# Altium schematic sheet CIRCUIT.SchDoc
size A3; DocumentNumber: 3; SheetNumber: 4; SheetTotal: 6; PageSetup: Record=PageOptions|CenterHorizontal=True|CenterVertical=True|PrintScale=1.00|XCorrection=1.00|YCorrection=1.00|PrintKind=1|BorderSize=5000000|LeftOffset=0|BottomOffset=0|Orientation=2|PaperLength=1000|PaperWidth=1000|Scale=100|PaperSource=7|PrintQuality=-3|MediaType=1|DitherType=10|PrintScaleMode=1|PaperKind=A4|PaperIndex=9
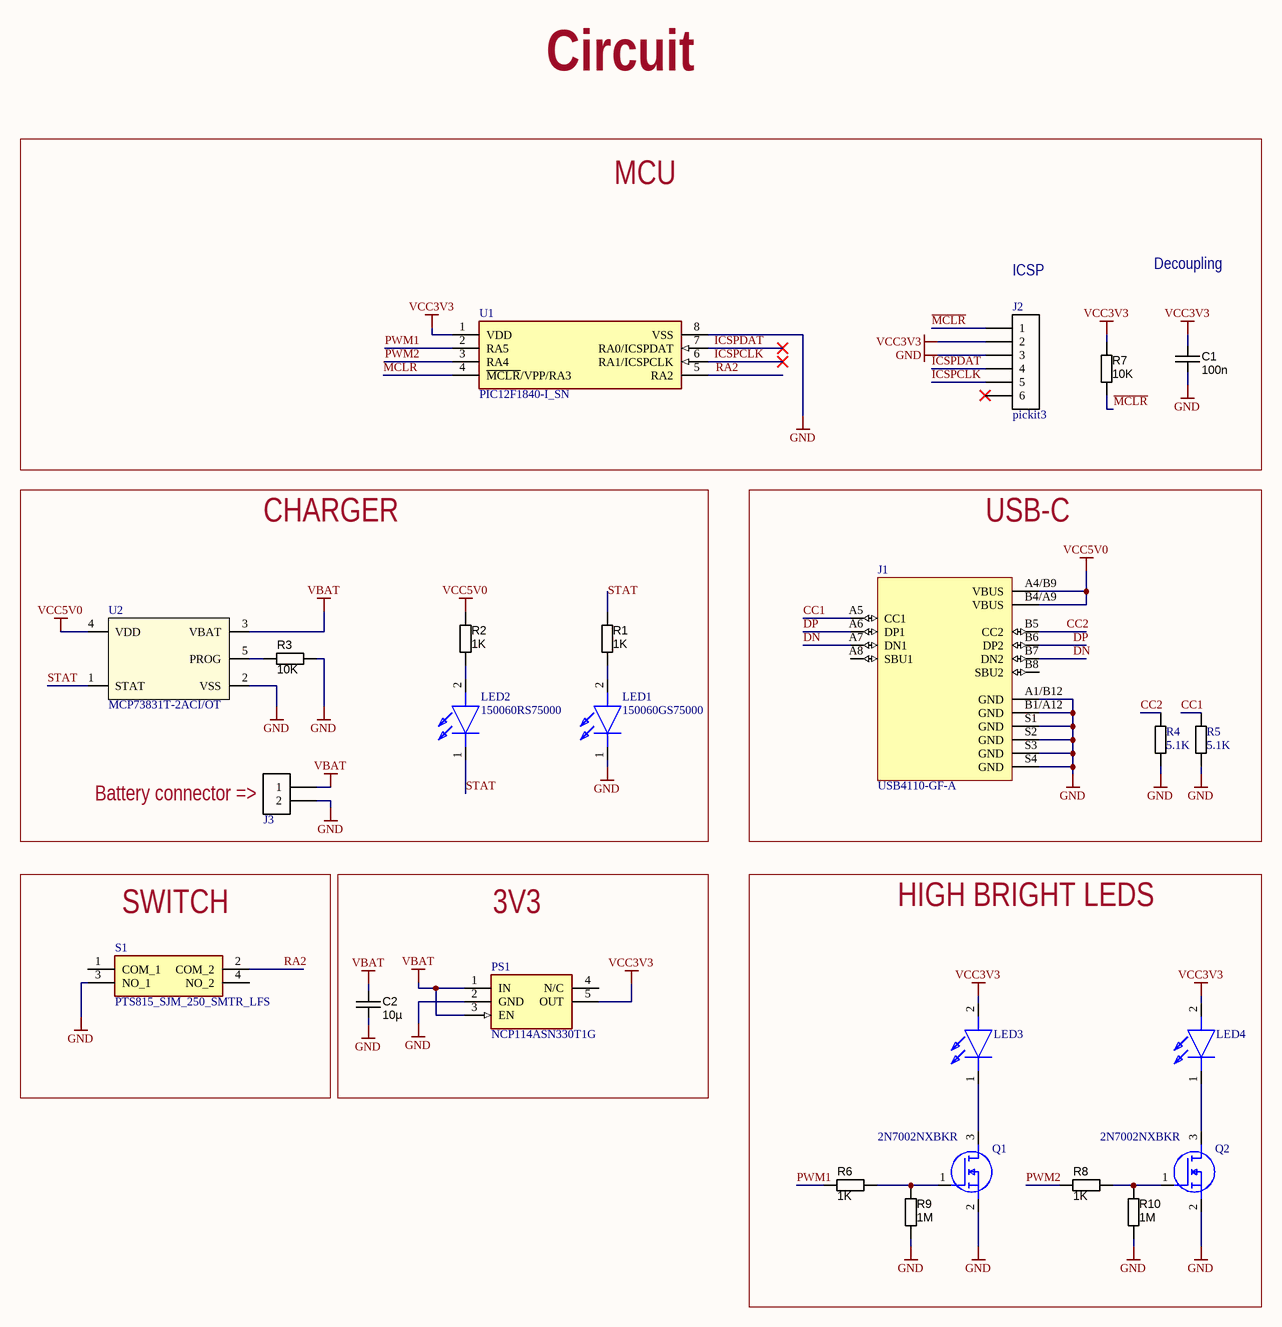
[diagram p0: CIRCUIT.SchDoc]

## Parts
C1  value 100n  [CAPC1608X90N]  (hidden comment: approved sub OK)
C2  value 10µ  [CAPC3216X180N]  (hidden comment: approved sub OK)
J1  USB4110-GF-A  [GCT_USB4110-GF-A]
J2  pickit3  [CONN_ICSP]  (no BOM)
J3  S2B-PH-K-S(LF)(SN)  [JST-S2B-PH-K-S_V]  (value not drawn)
LED1  150060GS75000  [LEDC1608X80N]
LED2  150060RS75000  [LEDC1608X80N]
LED3  S1W0-2835408003-0000003S-00005  [STW8A12DMinJ18CAAll]  (value not drawn)
LED4  S1W0-2835408003-0000003S-00005  [STW8A12DMinJ18CAAll]  (value not drawn)
PS1  NCP114ASN330T1G  [SOT95P275X110-5N]
Q1  2N7002NXBKR  [SOT95P230X110-3N]
Q2  2N7002NXBKR  [SOT95P230X110-3N]
R1  value 1K  [RESC1608X55N]  (hidden comment: Thick Film)
R2  value 1K  [RESC1608X55N]  (hidden comment: Thick Film)
R3  value 10K  [RESC1608X55N]  (hidden comment: Thick Film)
R4  value 5.1K  [RESC1608X55N]  (hidden comment: RES 5.1K OHM 5% 1/10W 0603)
R5  value 5.1K  [RESC1608X55N]  (hidden comment: RES 5.1K OHM 5% 1/10W 0603)
R6  value 1K  [RESC1608X55N]  (hidden comment: Thick Film)
R7  value 10K  [RESC1608X55N]  (hidden comment: Thick Film)
R8  value 1K  [RESC1608X55N]  (hidden comment: Thick Film)
R9  value 1M  [RESC1608X55N]  (hidden comment: Thick Film)
R10  value 1M  [RESC1608X55N]  (hidden comment: Thick Film)
S1  PTS815_SJM_250_SMTR_LFS  [PTS815SJM250SMTRLFS]
U1  PIC12F1840-I_SN  [SOIC127P600X175-8N]
U2  MCP73831T-2ACI/OT  [SOT-23-5_MC_MCH]

## Blocks framed on the sheet
MCU: C1 J2 R7 U1
CHARGER: J3 LED1 LED2 R1-R3 U2
USB-C: J1 R4 R5
SWITCH: S1
3V3: C2 PS1
HIGH BRIGHT LEDS: LED3 LED4 Q1 Q2 R6 R8-R10

## Nets
GND: C1.1 C2.2 J1.A1/B12(GND) J1.B1/A12(GND) J1.S1(GND) J1.S2(GND) J1.S3(GND) J1.S4(GND) J2.3 J3.2 LED1.1(K) PS1.2(GND) Q1.2(S) Q2.2(S) R3.2 R4.1 R5.1 R9.2 R10.2 S1.3(NO_1) U1.8(VSS) U2.2(VSS)
VBAT: C2.1 J3.1 PS1.1(IN) PS1.3(EN) U2.3(VBAT)
VCC3V3: C1.2 J2.2 LED3.2(A) LED4.2(A) PS1.5(OUT) R7.1 U1.1(VDD)
VCC5V0: J1.A4/B9(VBUS) J1.B4/A9(VBUS) R2.1 U2.4(VDD)
CC1: J1.A5(CC1) R5.2
CC2: J1.B5(CC2) R4.2
DN: J1.A7(DN1) J1.B7(DN2)
DP: J1.A6(DP1) J1.B6(DP2)
ICSPCLK: J2.5 U1.6(RA1/ICSPCLK)
ICSPDAT: J2.4 U1.7(RA0/ICSPDAT)
~{MCLR}: J2.1 R7.2 U1.4(~{MCLR}/VPP/RA3)
PWM1: R6.1 U1.2(RA5)
PWM2: R8.1 U1.3(RA4)
RA2: S1.2(COM_2) U1.5(RA2)
STAT: LED2.1(K) R1.1 U2.1(STAT)
NetLED1_2: LED1.2(A) R1.2
NetLED2_2: LED2.2(A) R2.2
NetLED3_1: LED3.1(K) Q1.3(D)
NetLED4_1: LED4.1(K) Q2.3(D)
NetQ1_1: Q1.1(G) R6.2 R9.1
NetQ2_1: Q2.1(G) R8.2 R10.1
NetR3_1: R3.1 U2.5(PROG)

Not connected (* = marked no-connect by the designer): J1 A8(SBU1) B8(SBU2); J2 6*; PS1 4(N/C); S1 1(COM_1) 4(NO_2)

## Notes on the sheet
- Circuit
- (near J2) ICSP
- Decoupling
- (near J3) Battery connector =>
- Project:
- Revision:
- Engineer:
- Title:
- Pag
- of
- Date:
- Hour:
- Variant:
- Embedded Things

## Library data of the parts
C1 = CAPC_100n_0603_X7R_50V_10%: Capacitor SMD Cer 100nF 10% 50V X7R 0603; Manufacturer 1: AVX Corporation; Manufacturer Part Number 1: 06035C104KAT2A; Ratings: 50V; X7R; Material: ceramic; SCDType: spec; Manufacturer 2: TDK Corporation; Manufacturer Part Number 2: C1608X7R1H104K; Package / Case: 0603 (1608 Metric); Tolerance: ±10%; Supplier 1: Digi-Key; Supplier Part Number 1: 478-5052-1-ND; ComponentLink1URL: http://www.avx.com/docs/Catalogs/cx7r.pdf; ComponentLink1Description: http://www.avx.com/docs/Catalogs/cx7r.pdf; Supplier 2: Digi-Key; Supplier Part Number 2: 445-1314-1-ND; ComponentLink2URL: http://product.tdk.com/capacitor/mlcc/en/documents/mlcc_commercial_general_en.pdf; ComponentLink2Description: http://product.tdk.com/capacitor/mlcc/en/documents/mlcc_commercial_general_en.pdf
C2 = CAPC_10u_1206_25V: Capacitor SMD Cer 10uF 10% 25V X7R 1206; Ratings: 16V; X7R; Material: ceramic; SCDType: spec; Package / Case: 1206 (3216 metric); Tolerance: ±10%; Supplier 1: Digi-Key; Supplier Part Number 1: 1276-1804-1-ND
J1 = USB4110-GF-A: USB-C _USB TYPE-C_ USB 2.0 Receptacle Connector 24 _16+8 Dummy_ Position Surface Mount, Right Angle; Through Hole; MF: GCT; Digi-Key_Purchase_URL: https://www.digikey.com/product-detail/en/gct/USB4110-GF-A/2073-USB4110-GF-A-1-ND/10384548?utm_source=snapeda&utm_medium=aggregator&utm_campaign=symbol; Value: *; Package: None; MP: USB4110-GF-A; SnapEDA_Link: https://www.snapeda.com/parts/USB4110-GF-A/Global%20Connector%20Technology/view-part/4001167/?ref=snap; Digi-Key_Part_Number: 2073-USB4110-GF-A-1-ND
J2 = CONN PROG PICKIT3: CONN PROG PICKIT3 6VIAS; pitch_in_mm: 2.54; device: pickit3
J3 = CONN JST 2P 2MM: Male Header, Pitch 2 mm, 1 x 2 Position, Height 4.8 mm, Tail Length 3.4 mm, -25 to 85 degC, RoHS, Bulk; Case\Package: Radial; Tolerance: 20%; Capacitance: 10 uF; Voltage Rating (DC): 50 V; Packaging: Bulk; ComponentLink1URL: http://www.jst-mfg.com/product/pdf/eng/ePH.pdf; Radiation Hardening: No; Height: 11 mm; Package Quantity: 200; PackageDescription: Male Header, Pitch 2 mm, 1 x 2 Position, Height 4.8 mm, Tail Length 3.4 mm; PackageReference: S2B-PH-K-S; Diameter: 5 mm; Pins: 2; Mount: Through Hole; Max Operating Temperature: 85 degC; Min Operating Temperature: -40 degC; ComponentLink1Description: Datasheet; DatasheetVersion: Dec-12; Length: 11 mm; Lead Pitch: 2 mm; REACH SVHC: No SVHC; Voltage Rating: 50 V; RoHSCompliant: true
LED1 = 150060GS75000: LED; Manufacturer_Name: Wurth Elektronik; Datasheet Link: https://componentsearchengine.com/Datasheets/2/150060GS75000.pdf; Height: 0.8mm; Manufacturer_Part_Number: 150060GS75000; Mouser Part Number: 710-150060GS75000; Mouser Price/Stock: https://www.mouser.co.uk/ProductDetail/Wurth-Elektronik/150060GS75000?qs=LlUlMxKIyB0UYkq5lDO8nA%3D%3D
LED2 = 150060RS75000: LED; Manufacturer_Name: Wurth Elektronik; Datasheet Link: http://katalog.we-online.de/led/datasheet/150060RS75000.pdf; Height: 0.8mm; Manufacturer_Part_Number: 150060RS75000; Mouser Part Number: 710-150060RS75000; Mouser Price/Stock: https://www.mouser.co.uk/ProductDetail/Wurth-Elektronik/150060RS75000?qs=LlUlMxKIyB3QnmZ3fw%2FVCA%3D%3D
LED3 LED4 = S1W0-2835408003-0000003S-00005: LED; Manufacturer_Name: SEOUL SEMICONDUCTOR; Datasheet Link: http://seoulsemicon.com/upload2/STW8A12D_S1.pdf; Height: 0mm; Manufacturer_Part_Number: S1W0-2835408003-0000003S-00005
PS1 = NCP114ASN330T1G: Power Supply; Manufacturer_Name: ON Semiconductor; Datasheet Link: https://componentsearchengine.com/Datasheets/2/NCP114ASN330T1G.pdf; Height: 1.1mm; Manufacturer_Part_Number: NCP114ASN330T1G; Arrow Part Number: NCP114ASN330T1G; Arrow Price/Stock: https://www.arrow.com/en/products/ncp114asn330t1g/on-semiconductor; Mouser Part Number: 863-NCP114ASN330T1G; Mouser Price/Stock: https://www.mouser.co.uk/ProductDetail/ON-Semiconductor/NCP114ASN330T1G?qs=OycAS1CGnljPBnaqdh%252BGIA%3D%3D
Q1 Q2 = 2N7002NXBKR: MOSFET (N-Channel); Manufacturer_Name: Nexperia; Datasheet Link: https://componentsearchengine.com/Datasheets/1/2N7002NXBKR.pdf; Height: 1.1mm; Manufacturer_Part_Number: 2N7002NXBKR; Arrow Part Number: 2N7002NXBKR; Arrow Price/Stock: https://www.arrow.com/en/products/2n7002nxbkr/nexperia; Mouser Part Number: 771-2N7002NXBKR; Mouser Price/Stock: https://www.mouser.co.uk/ProductDetail/Nexperia/2N7002NXBKR?qs=%252B6g0mu59x7J2ddJstTJGkQ%3D%3D
R1 R2 R6 R8 = RES_1K_0603_5%: Resistor SMD chip 1k Ohm 0.1W 5% 0603; Manufacturer 1: Yageo; Manufacturer Part Number 1: RC0603JR-071KL; Ratings: 1/10 W; SCDType: spec; Package / Case: 0603 (1608 metric); Tolerance: ±5%; Material: Thick Film; Supplier 1: Digi-Key; Supplier Part Number 1: 311-1.0KGRCT-ND; Supplier 2: Digi-Key; Supplier Part Number 2: 541-1.0KGCT-ND; Manufacturer 2: Vishay Dale; Manufacturer Part Number 2: CRCW06031K00JNEA; ComponentLink2URL: http://www.vishay.com/doc?20008; ComponentLink2Description: http://www.vishay.com/doc?20008; ComponentLink1URL: http://www.yageo.com/documents/recent/PYu-RC0603_51_RoHS_L_4.pdf; ComponentLink1Description: http://www.yageo.com/documents/recent/PYu-RC0603_51_RoHS_L_4.pdf
R3 R7 = RES_10K_0603_5%: Resistor SMD chip 10k Ohm 0.1W 5% 0603; Manufacturer 1: Yageo; Manufacturer Part Number 1: RC0603JR-0710KL; Ratings: 1/10 W; SCDType: spec; Package / Case: 0603 (1608 metric); Tolerance: ±5%; Material: Thick Film; Supplier 1: Digi-Key; Supplier Part Number 1: 311-10KGRCT-ND; Supplier 2: Digi-Key; Supplier Part Number 2: 541-10KGCT-ND; Manufacturer 2: Vishay Dale; Manufacturer Part Number 2: CRCW060310K0JNEA; ComponentLink2URL: http://www.vishay.com/doc?20035; ComponentLink2Description: http://www.vishay.com/doc?20035; ComponentLink1URL: http://www.yageo.com/documents/recent/PYu-RC0603_51_RoHS_L_4.pdf; ComponentLink1Description: http://www.yageo.com/documents/recent/PYu-RC0603_51_RoHS_L_4.pdf
R4 R5 = RES 5.1K OHM 5% 1/10W 0603: 5.1 kOhms ±5% 0.1W, 1/10W Chip Resistor 0603 (1608 Metric) Automotive AEC-Q200, Moisture Resistant Thick Film; Supplier 1: Digi-Key; Supplier Part Number 1: 2019-RK73B1JTTD512JCT-ND
R9 R10 = RES_1M_0603_5%: Resistor SMD chip 1M Ohm 0.1W 5% 0603; Manufacturer 1: Vishay Dale; Manufacturer Part Number 1: CRCW06031M00JNEA; Ratings: 1/10 W; SCDType: spec; Package / Case: 0603 (1608 metric); Tolerance: ±5%; Material: Thick Film; Supplier 1: Digi-Key; Supplier Part Number 1: 541-1.0MGCT-ND; ComponentLink1URL: http://www.vishay.com/doc?20008; ComponentLink1Description: http://www.vishay.com/doc?20008; Supplier 2: Digi-Key; Supplier Part Number 2: 311-1.0MGRCT-ND; ComponentLink2URL: http://www.yageo.com/documents/recent/PYu-RC0603_51_RoHS_L_4.pdf; ComponentLink2Description: http://www.yageo.com/documents/recent/PYu-RC0603_51_RoHS_L_4.pdf; Manufacturer 2: Yageo; Manufacturer Part Number 2: RC0603JR-071ML
S1 = PTS815_SJM_250_SMTR_LFS: Switch; Manufacturer_Name: C & K COMPONENTS; Manufacturer_Part_Number: PTS815 SJM 250 SMTR LFS; Datasheet Link: https://componentsearchengine.com/Datasheets/1/PTS815 SJM 250 SMTR LFS.pdf; Height: 2.7mm; Arrow Part Number: PTS815 SJM 250 SMTR LFS; Arrow Price/Stock: https://www.arrow.com/en/products/pts815-sjm-250-smtr-lfs/ck; Mouser Part Number: 611-PTS815SJM250SMTR; Mouser Price/Stock: https://www.mouser.co.uk/ProductDetail/CK/PTS815-SJM-250-SMTR-LFS?qs=ahcBuItHZ3xKWmfV%2F2E6bA%3D%3D
U1 = PIC12F1840-I_SN: Integrated Circuit; Manufacturer_Name: Microchip; Manufacturer_Part_Number: PIC12F1840-I/SN; Datasheet Link: http://ww1.microchip.com/downloads/en/DeviceDoc/40001441F.pdf; Height: 1.75mm; Arrow Part Number: PIC12F1840-I/SN; Arrow Price/Stock: https://www.arrow.com/en/products/pic12f1840-isn/microchip-technology; Mouser Part Number: 579-PIC12F1840-I/SN; Mouser Price/Stock: https://www.mouser.co.uk/ProductDetail/Microchip-Technology/PIC12F1840-I-SN?qs=gdymDg%2FOn%252BGgQL%2FWyG8YaA%3D%3D
U2 = MCP73831T-2ACI/O: No Description Available; Vendor: Microchip; Built_By: EMA_UL_Team; SourceLibrary: Microchip_2011-05-13; Manufacturer_Part_Number: MCP73831T-2ACI/OT; Copyright: Copyright (C) 2018 Accelerated Designs. All rights reserved; RefDes: RefDes; Type: DEV